# Altium schematic sheet 0_COVER.SchDoc: SmartHalo - Cover
size B; Author: Sébastien Gélinas; Organization: SmartHalo; Address1: 5445 de Gaspé; Address2: Montréal, QC; Address3: Canada; Address4: H2T 3B2; DocumentNumber: 1; Revision: 1; SheetNumber: 0; SheetTotal: 7
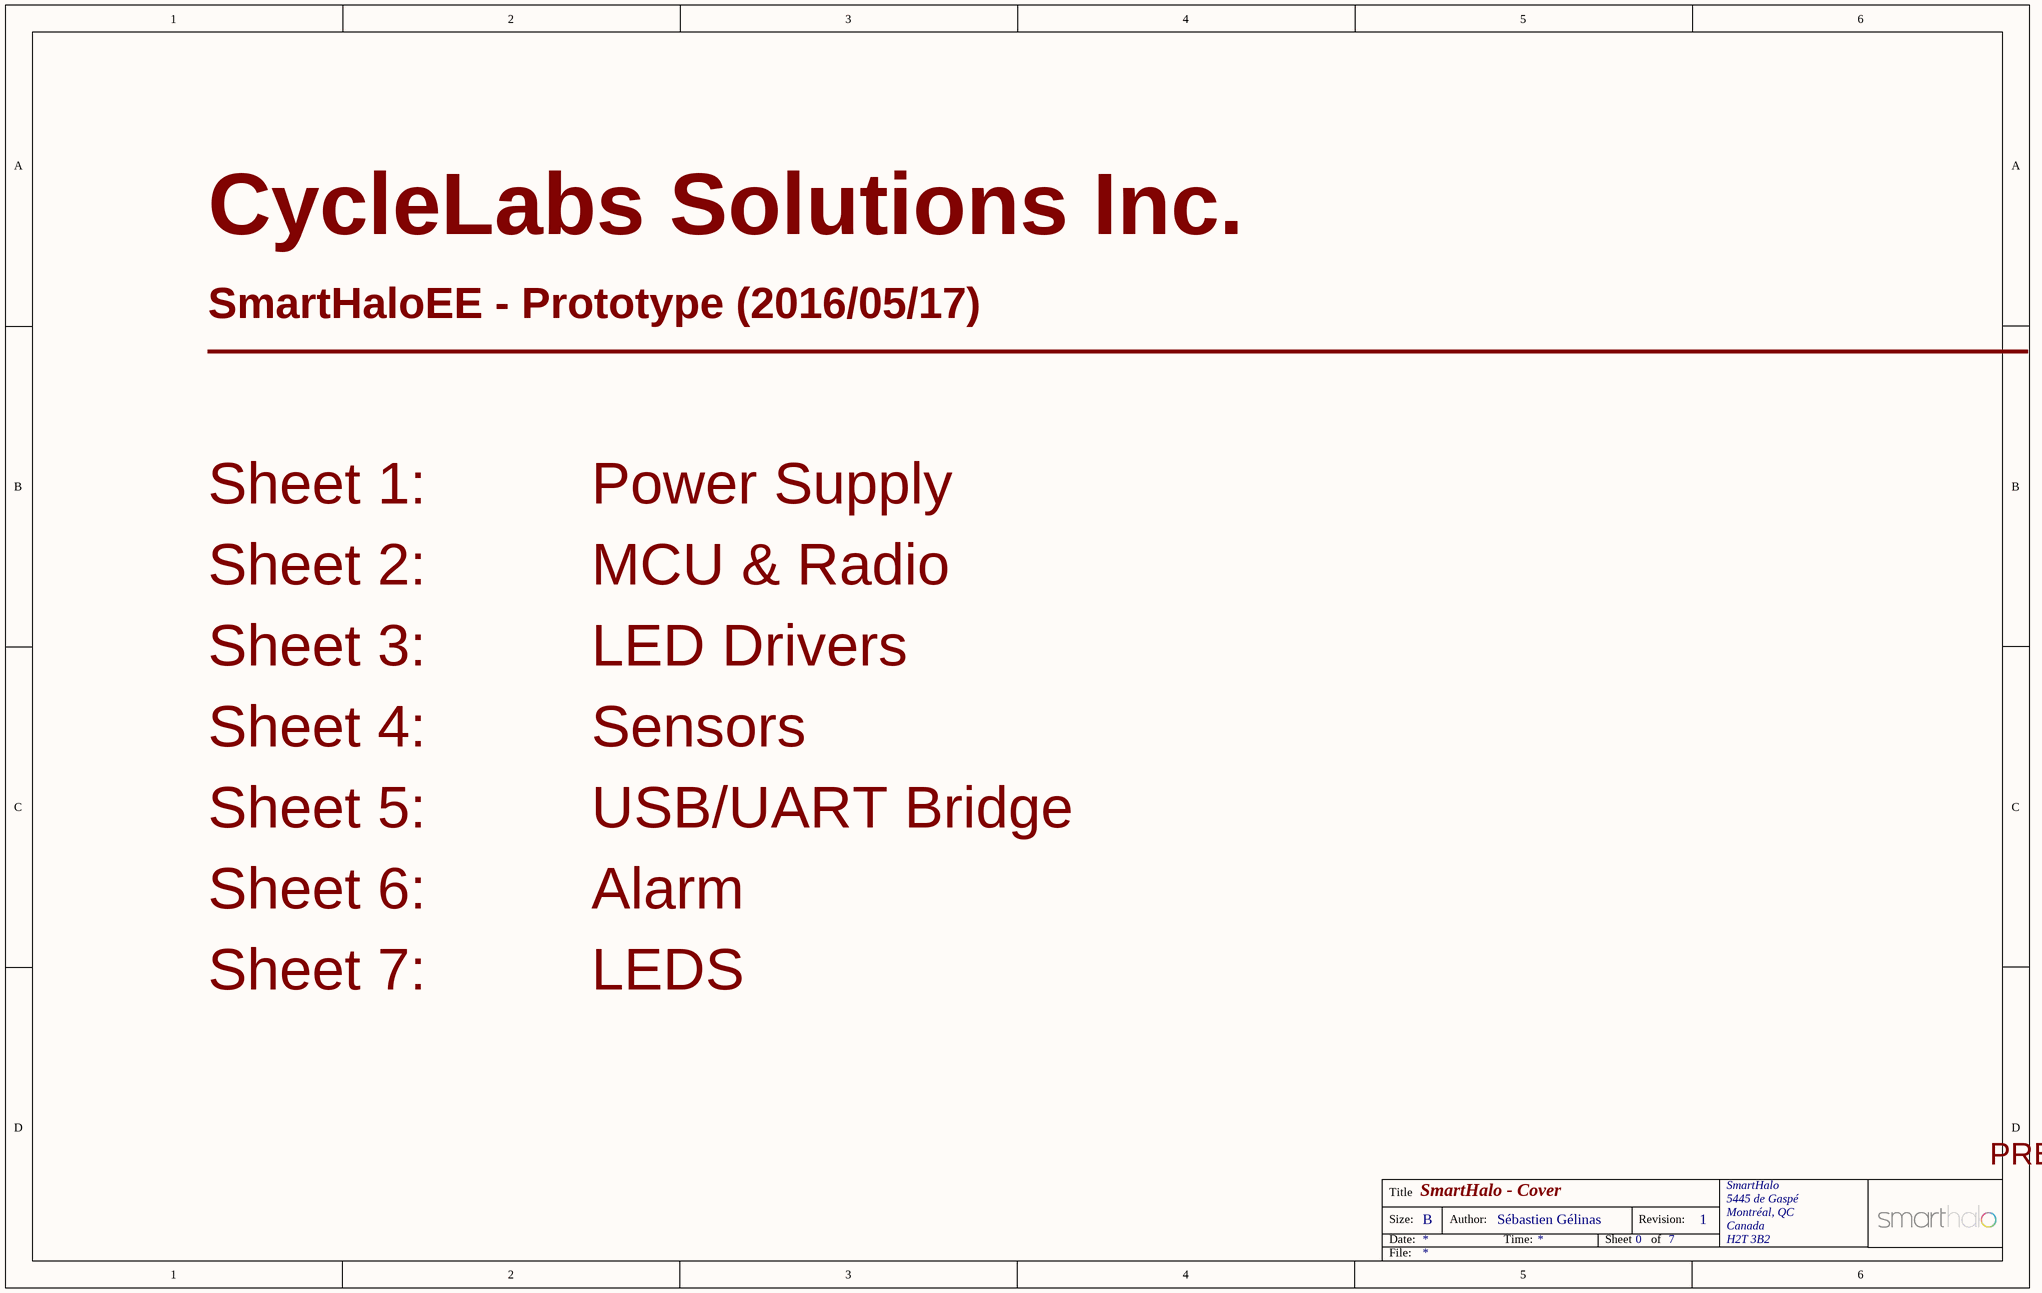
[diagram p0: 0_COVER.SchDoc]

## Notes on the sheet
- CycleLabs Solutions Inc.
- SmartHaloEE - Prototype (2016/05/17)
- ________________________________________________________
- Sheet 1:          Power Supply
- Sheet 2:          MCU & Radio
- Sheet 3:          LED Drivers
- Sheet 4:          Sensors
- Sheet 5:          USB/UART Bridge
- Sheet 6:          Alarm
- Sheet 7:          LEDS
- PRELIMINARY: DO NOT USE FOR PRODUCTION
- Title
- Size:
- Date:
- B
- Author:
- Time:
- Sheet
- Revision:
- of
- File: